# EAGLE schematic bus_schematic (EAGLE 9.2.2)
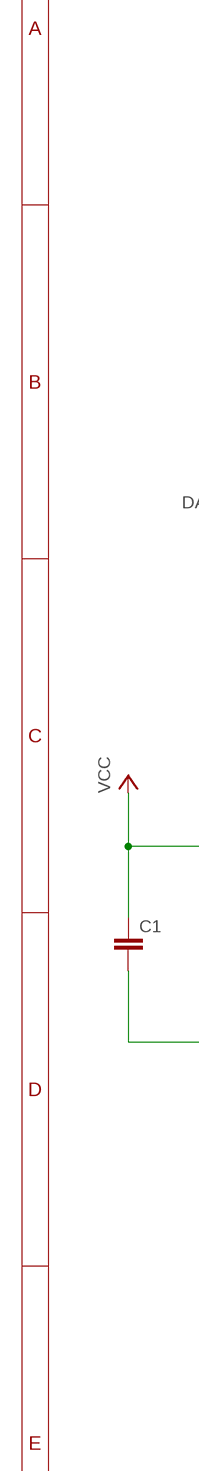
[diagram p0: schematic, sheet 1, part 1 of 2]
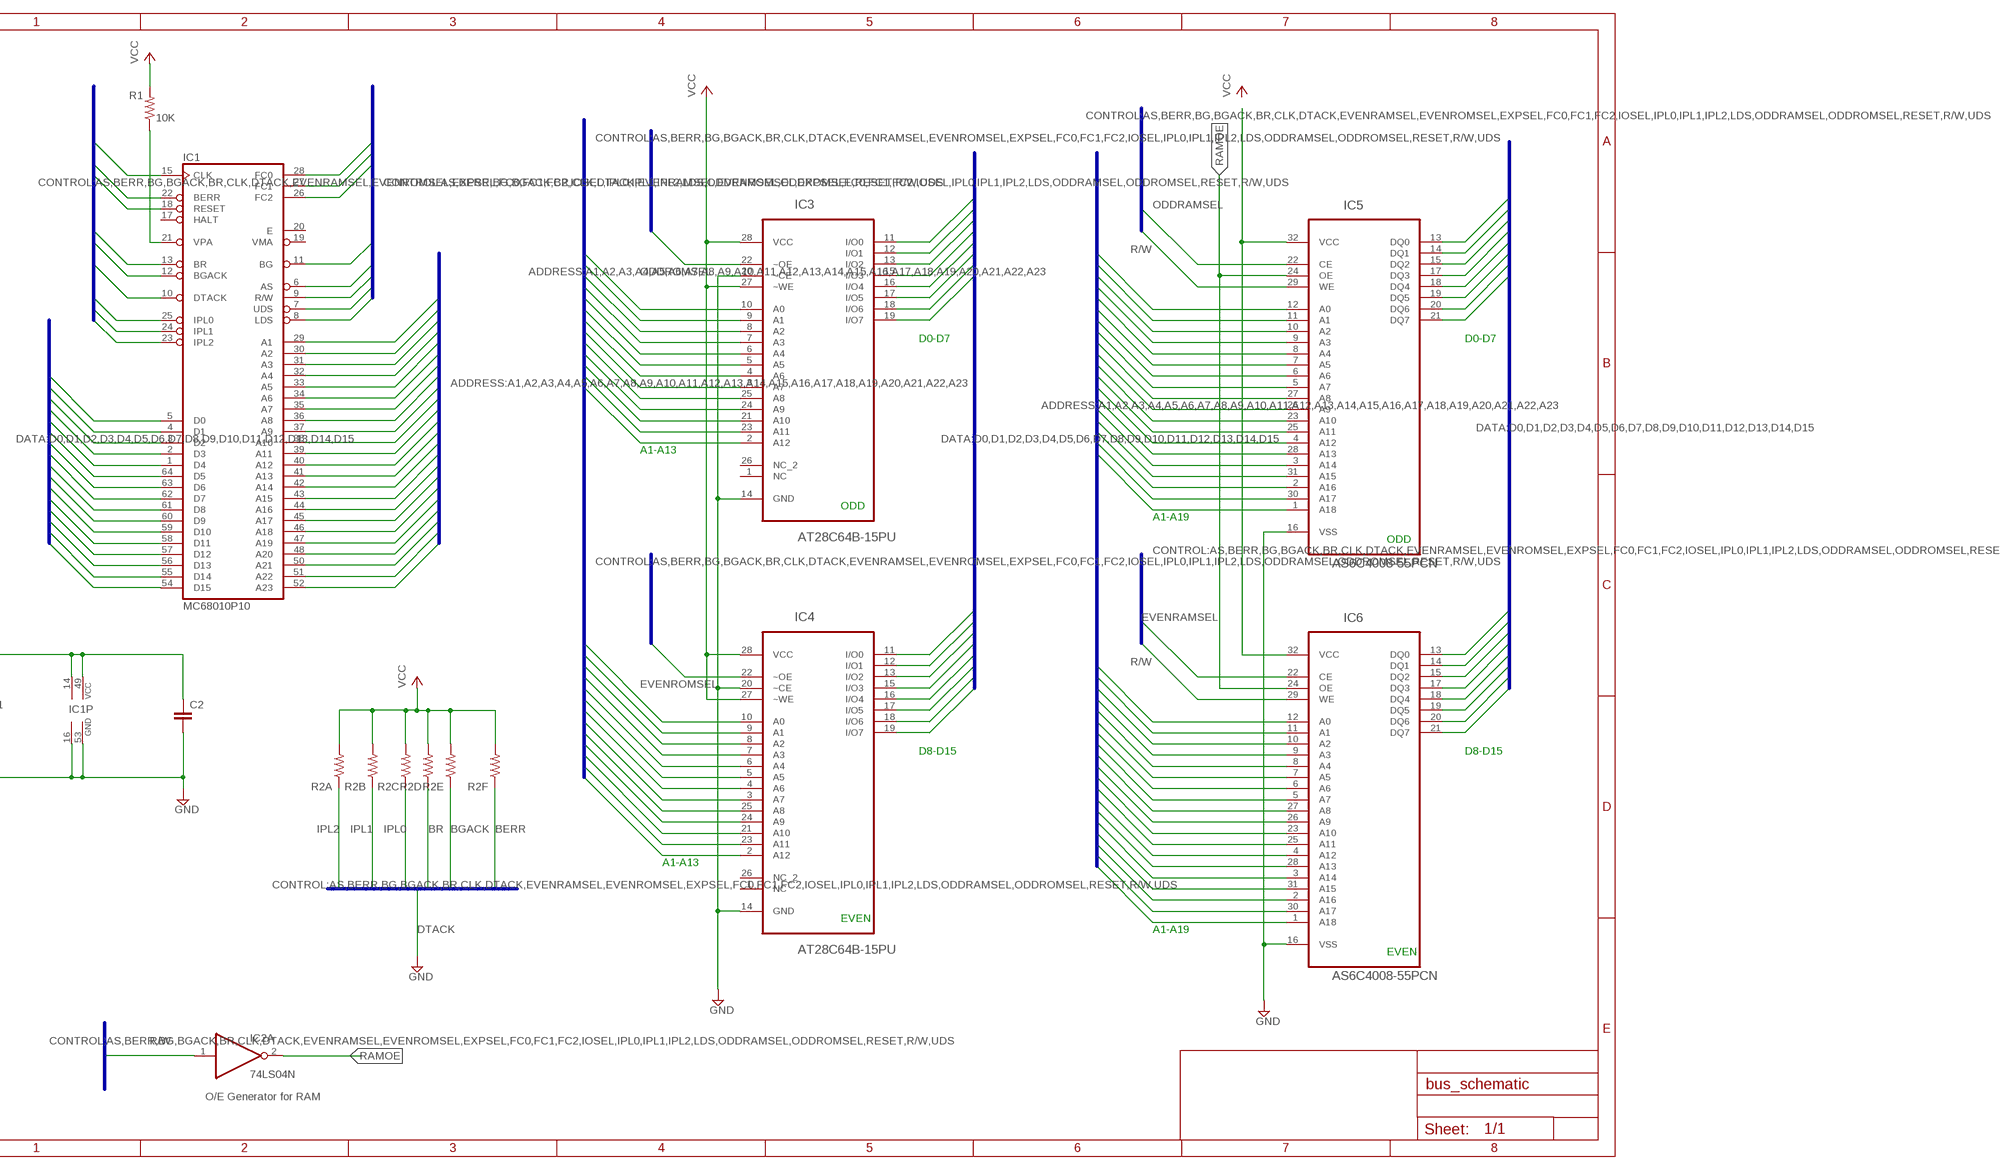
[diagram p1: schematic, sheet 1, part 2 of 2]

## Parts
C1  C2.5/2  [C2.5-2]
C2  C2.5/2  [C2.5-2]
IC1  MC68010P10  MC68000P  [DIL64]
IC2  74LS04N  [DIL14]
IC3  AT28C64B-15PU  [DIP254P1524X482-28]
IC4  AT28C64B-15PU  [DIP254P1524X482-28]
IC5  AS6C4008-55PCN  [DIP254P1524X393-32]
IC6  AS6C4008-55PCN  [DIP254P1524X393-32]
R1  10K  R-US_0207/10  [0207/10]
R2A  R-US_0207/10  [0207/10]
R2B  R-US_0207/10  [0207/10]
R2C  R-US_0207/10  [0207/10]
R2D  R-US_0207/10  [0207/10]
R2E  R-US_0207/10  [0207/10]
R2F  R-US_0207/10  [0207/10]

## Nets
A1: IC1.29(A1) IC3.10(A0) IC4.10(A0) IC5.12(A0) IC6.12(A0)
A2: IC1.30(A2) IC3.9(A1) IC4.9(A1) IC5.11(A1) IC6.11(A1)
A3: IC1.31(A3) IC3.8(A2) IC4.8(A2) IC5.10(A2) IC6.10(A2)
A4: IC1.32(A4) IC3.7(A3) IC4.7(A3) IC5.9(A3) IC6.9(A3)
A5: IC1.33(A5) IC3.6(A4) IC4.6(A4) IC5.8(A4) IC6.8(A4)
A6: IC1.34(A6) IC3.5(A5) IC4.5(A5) IC5.7(A5) IC6.7(A5)
A7: IC1.35(A7) IC3.4(A6) IC4.4(A6) IC5.6(A6) IC6.6(A6)
A8: IC1.36(A8) IC3.3(A7) IC4.3(A7) IC5.5(A7) IC6.5(A7)
A9: IC1.37(A9) IC3.25(A8) IC4.25(A8) IC5.27(A8) IC6.27(A8)
A10: IC1.38(A10) IC3.24(A9) IC4.24(A9) IC5.26(A9) IC6.26(A9)
A11: IC1.39(A11) IC3.21(A10) IC4.21(A10) IC5.23(A10) IC6.23(A10)
A12: IC1.40(A12) IC3.23(A11) IC4.23(A11) IC5.25(A11) IC6.25(A11)
A13: IC1.41(A13) IC3.2(A12) IC4.2(A12) IC5.4(A12) IC6.4(A12)
A14: IC1.42(A14) IC5.28(A13) IC6.28(A13)
A15: IC1.43(A15) IC5.3(A14) IC6.3(A14)
A16: IC1.44(A16) IC5.31(A15) IC6.31(A15)
A17: IC1.45(A17) IC5.2(A16) IC6.2(A16)
A18: IC1.46(A18) IC5.30(A17) IC6.30(A17)
A19: IC1.47(A19) IC5.1(A18) IC6.1(A18)
A20: IC1.48(A20)
A21: IC1.50(A21)
A22: IC1.51(A22)
A23: IC1.52(A23)
AS: IC1.6(AS)
BERR: IC1.22(BERR) R2F.1
BG: IC1.11(BG)
BGACK: IC1.12(BGACK) R2E.1
BR: IC1.13(BR) R2D.1
CLK: IC1.15(CLK)
D0: IC1.5(D0) IC3.11(I/O0) IC5.13(DQ0)
D1: IC1.4(D1) IC3.12(I/O1) IC5.14(DQ1)
D2: IC1.3(D2) IC3.13(I/O2) IC5.15(DQ2)
D3: IC1.2(D3) IC3.15(I/O3) IC5.17(DQ3)
D4: IC1.1(D4) IC3.16(I/O4) IC5.18(DQ4)
D5: IC1.64(D5) IC3.17(I/O5) IC5.19(DQ5)
D6: IC1.63(D6) IC3.18(I/O6) IC5.20(DQ6)
D7: IC1.62(D7) IC3.19(I/O7) IC5.21(DQ7)
D8: IC1.61(D8) IC4.11(I/O0) IC6.13(DQ0)
D9: IC1.60(D9) IC4.12(I/O1) IC6.14(DQ1)
D10: IC1.59(D10) IC4.13(I/O2) IC6.15(DQ2)
D11: IC1.58(D11) IC4.15(I/O3) IC6.17(DQ3)
D12: IC1.57(D12) IC4.16(I/O4) IC6.18(DQ4)
D13: IC1.56(D13) IC4.17(I/O5) IC6.19(DQ5)
D14: IC1.55(D14) IC4.18(I/O6) IC6.20(DQ6)
D15: IC1.54(D15) IC4.19(I/O7) IC6.21(DQ7)
DTACK: IC1.10(DTACK) ; supply symbol labelled GND
EVENRAMSEL: IC6.22(CE)
EVENROMSEL: IC4.22(~OE)
FC0: IC1.28(FC0)
FC1: IC1.27(FC1)
FC2: IC1.26(FC2)
GND: C1.2 C2.2 IC1.16(GND) IC1.53(GND) IC3.14(GND) IC3.20(~CE) IC4.14(GND) IC4.20(~CE) IC5.16(VSS) IC6.16(VSS)
IPL0: IC1.25(IPL0) R2C.1
IPL1: IC1.24(IPL1) R2B.1
IPL2: IC1.23(IPL2) R2A.1
LDS: IC1.8(LDS)
N$1: IC5.32(VCC) IC6.32(VCC)
N$2: IC1.21(VPA) R1.1
ODDRAMSEL: IC5.22(CE)
ODDROMSEL: IC3.22(~OE)
R/W: IC1.9(R/W) IC2.1(A:I) IC5.29(WE) IC6.29(WE)
RAMOE: IC2.2(A:O) IC5.24(OE) IC6.24(OE)
RESET: IC1.18(RESET)
UDS: IC1.7(UDS)
VCC: C1.1 C2.1 IC1.14(VCC) IC1.49(VCC) IC3.27(~WE) IC3.28(VCC) IC4.27(~WE) IC4.28(VCC) R1.2 R2A.2 R2B.2 R2C.2 R2D.2 R2E.2 R2F.2
Unconnected: IC1.17(HALT) IC1.19(VMA) IC1.20(E) IC2.3(B:I) IC2.4(B:O) IC2.5(C:I) IC2.6(C:O) IC2.8(D:O) IC2.9(D:I) IC2.10(E:O) IC2.11(E:I) IC2.12(F:O) IC2.13(F:I) IC3.1(NC) IC3.26(NC_2) IC4.1(NC) IC4.26(NC_2)

## Buses
ADDRESS:A1,A2,A3,A4,A5,A6,A7,A8,A9,A10,A11,A12,A13,A14,A15,A16,A17,A18,A19,A20,A21,A22,A23
DATA:D0,D1,D2,D3,D4,D5,D6,D7,D8,D9,D10,D11,D12,D13,D14,D15
CONTROL:AS,BERR,BG,BGACK,BR,CLK,DTACK,EVENRAMSEL,EVENROMSEL,EXPSEL,FC0,FC1,FC2,IOSEL,IPL0,IPL1,IPL2,LDS,ODDRAMSEL,ODDROMSEL,RESET,R/W,UDS

## Notes on the sheet
- D0-D7 | D0-D7
- A1-A13
- ODD
- A1-A19
- ODD
- D8-D15 | D8-D15
- A1-A13
- EVEN
- A1-A19
- EVEN
- O/E Generator for RAM

## Power pins joined to a net without a drawn wire
GND: IC2.7(P:GND)
VCC: IC2.14(P:VCC)

## Library data of the parts
C1 C2 = capacitor-wima:C: CAPACITOR naming: grid - package width
IC1 = micro-mc68000:MC68000P: 68xxx PROCESSOR; OC_FARNELL: unknown; OC_NEWARK: unknown
IC2 = 74xx-eu:74*04: Hex INVERTER
IC3 IC4 = Atmel_By_element14_Batch_1-00:AT28C64B-15PU: Parallel EEPROM; DESCRIPTION: Parallel EEPROM; MPN: AT28C64B-15PU; OC_FARNELL: 1095784; OC_NEWARK: 96K6557; PACKAGE: PCDIP-28; SUPPLIER: ATMEL
IC5 IC6 = Alliance_By_element14:AS6C4008-55PCN: CMOS SRAM; MPN: AS6C4008-55PCN; OC_FARNELL: 1562900; OC_NEWARK: 94M6217; PACKAGE: DIP-32; SUPPLIER: ALLIANCE MEMORY
R1 R2A R2B R2C R2D R2E R2F = rcl:R-US_: RESISTOR, American symbol; SPICEPREFIX: R